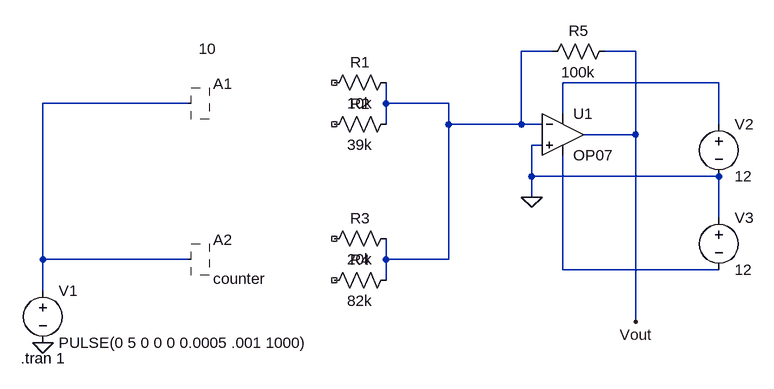
[diagram p0: schematic DAQ_Draft.asc]
DAQ_Draft.asc, the LTspice schematic file:
Version 4
SHEET 1 880 680
WIRE 496 80 448 80
WIRE 624 80 576 80
WIRE 752 128 512 128
WIRE -64 160 -288 160
WIRE 240 160 240 128
WIRE 336 160 240 160
WIRE 512 176 512 128
WIRE 240 192 240 160
WIRE 336 192 336 160
WIRE 448 192 448 80
WIRE 448 192 336 192
WIRE 480 192 448 192
WIRE 752 192 752 128
WIRE 624 208 624 80
WIRE 624 208 544 208
WIRE 480 224 464 224
WIRE 464 272 464 224
WIRE 752 272 464 272
WIRE 464 304 464 272
WIRE 752 336 752 272
WIRE -288 400 -288 160
WIRE -64 400 -288 400
WIRE 240 400 240 368
WIRE 336 400 336 192
WIRE 336 400 240 400
WIRE 512 416 512 240
WIRE 752 416 512 416
WIRE 240 432 240 400
WIRE -288 448 -288 400
WIRE 624 496 624 208
FLAG -288 528 0
FLAG 464 304 0
FLAG 624 496 Vout
SYMBOL Digital\\counter 16 128 R0
WINDOW 3 -64 -52 Left 2
SYMATTR InstName A1
SYMATTR Value 10
SYMBOL Digital\\counter 16 368 R0
SYMATTR InstName A2
SYMBOL res 256 112 R90
WINDOW 0 0 56 VBottom 2
WINDOW 3 32 56 VTop 2
SYMATTR InstName R1
SYMATTR Value 10k
SYMBOL res 256 176 R90
WINDOW 0 0 56 VBottom 2
WINDOW 3 32 56 VTop 2
SYMATTR InstName R2
SYMATTR Value 39k
SYMBOL res 256 352 R90
WINDOW 0 0 56 VBottom 2
WINDOW 3 32 56 VTop 2
SYMATTR InstName R3
SYMATTR Value 20k
SYMBOL res 256 416 R90
WINDOW 0 0 56 VBottom 2
WINDOW 3 32 56 VTop 2
SYMATTR InstName R4
SYMATTR Value 82k
SYMBOL voltage -288 432 R0
WINDOW 123 0 0 Left 0
WINDOW 39 0 0 Left 0
SYMATTR InstName V1
SYMATTR Value PULSE(0 5 0 0 0 0.0005 .001 1000)
SYMBOL res 592 64 R90
WINDOW 0 0 56 VBottom 2
WINDOW 3 32 56 VTop 2
SYMATTR InstName R5
SYMATTR Value 100k
SYMBOL OpAmps\\OP07 512 144 R0
SYMATTR InstName U1
SYMBOL voltage 752 176 R0
WINDOW 123 0 0 Left 0
WINDOW 39 0 0 Left 0
SYMATTR InstName V2
SYMATTR Value 12
SYMBOL voltage 752 320 R0
WINDOW 123 0 0 Left 0
WINDOW 39 0 0 Left 0
SYMATTR InstName V3
SYMATTR Value 12
TEXT -322 552 Left 2 !.tran 1

The netlist it stands for:
* DAQ_Draft.asc
* A1: 10 (symbol Digital\counter not available, pin order unknown); nets seen at it: N003
* A2: counter (symbol Digital\counter not available, pin order unknown); nets seen at it: N003
R1 N001 NC_01 10k
R2 N001 NC_02 39k
R3 N001 NC_03 20k
R4 N001 NC_04 82k
V1 N003 0 PULSE(0 5 0 0 0 0.0005 .001 1000)
R5 Vout N001 100k
XU1 0 N001 N002 N004 Vout LT1001  ; OP07, pins In+ In- V+ V- OUT
V2 N002 0 12
V3 0 N004 12
.tran 1
.lib LTC.lib
.backanno
.end